# EAGLE design keyBoard (EAGLE 8.3.2)
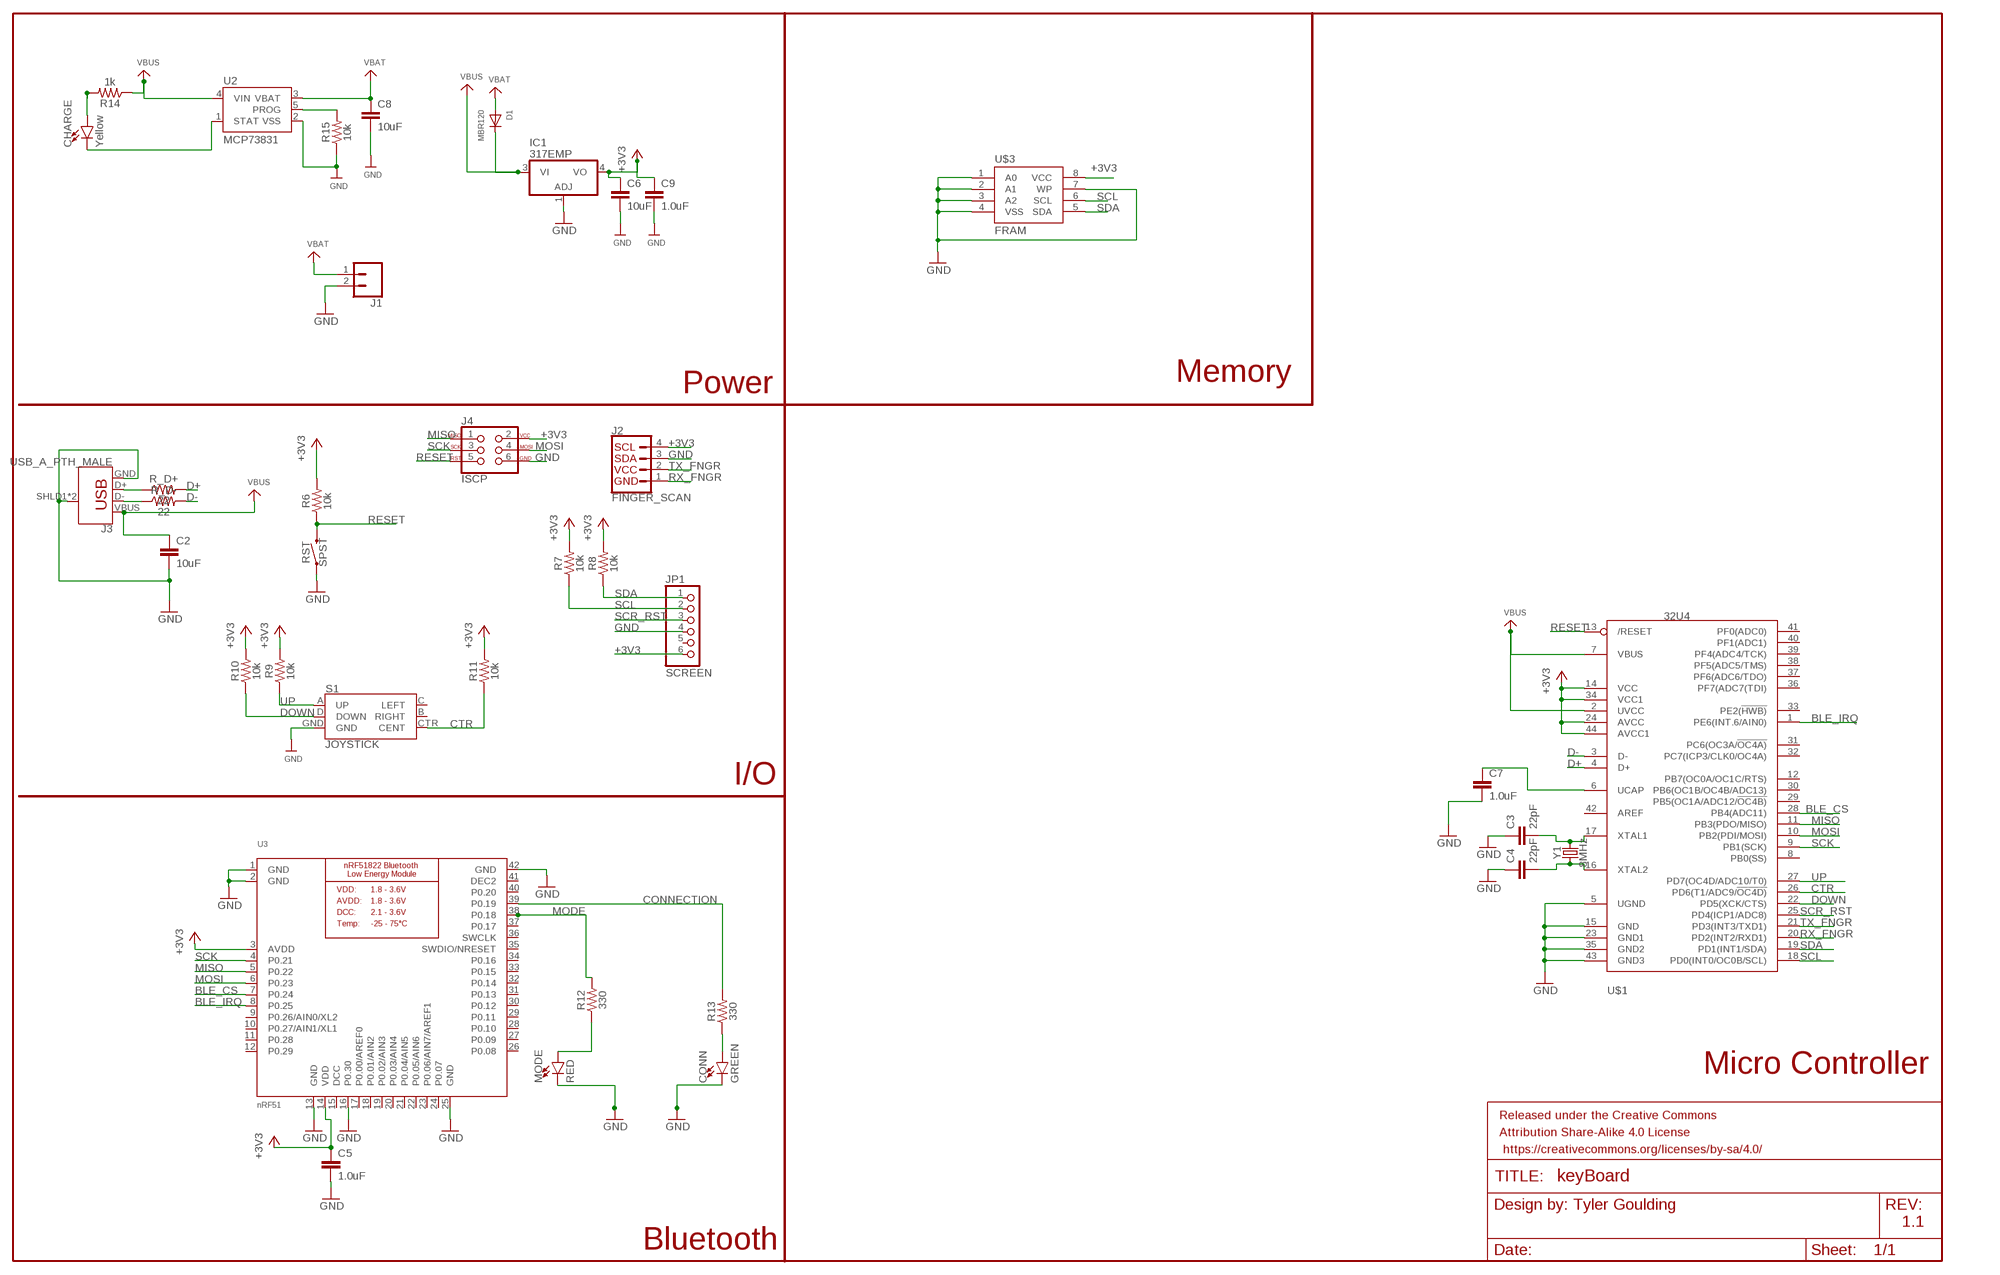
[diagram p0: schematic, sheet 1]

## Parts
C2  10uF  10UF-0603-6.3V-20%  [0603]
C3  22pF  22PF-0603-50V-5%  [0603]
C4  22pF  22PF-0603-50V-5%  [0603]
C5  1.0uF  1.0UF-0603-16V-10%  [0603]
C6  10uF  10UF-0603-6.3V-20%  [0603]
C7  1.0uF  1.0UF-0603-16V-10%  [0603]
C8  10uF  10UF-0603-6.3V-20%  [0603]
C9  1.0uF  1.0UF-0603-16V-10%  [0603]
CHARGE  Yellow  LED-YELLOW0603  [LED-0603]
CONN  GREEN  LED-GREEN0603  [LED-0603]
D1  MBR120  DIODE_SOD-123FL  [SOD-123FL]
FRAME1  FRAME-LEDGER  [CREATIVE_COMMONS]
IC1  317EMP  [SOT223]
J1  CONN_02JST-PTH-2  [JST-2-PTH]
J2  FINGER_SCAN  QWIIC_CONNECTORJS-1MM  [1X04_1MM_RA]
J3  USB_A_PTH_MALE  [USB-A-H]
J4  ISCP  AVR_SPI_PROG_3X2NS  [2X3-NS]
JP1  SCREEN  HEADER-1X6ROUND  [1X06_ROUND]
MODE  RED  LED-RED0603  [LED-0603]
R6  10k  10KOHM-0603-1/10W-1%  [0603]
R7  10k  10KOHM-0603-1/10W-1%  [0603]
R8  10k  10KOHM-0603-1/10W-1%  [0603]
R9  10k  10KOHM-0603-1/10W-1%  [0603]
R10  10k  10KOHM-0603-1/10W-1%  [0603]
R11  10k  10KOHM-0603-1/10W-1%  [0603]
R12  330  330OHM-0603-1/10W-1%  [0603]
R13  330  330OHM-0603-1/10W-1%  [0603]
R14  1k  1KOHM-0603-1/10W-1%  [0603]
R15  10k  10KOHM-0603-1/10W-1%  [0603]
R_D+  22  22OHM-0603-1/10W-1%  [0603]
R_D-  22  22OHM-0603-1/10W-1%  [0603]
RST  SPST  MOMENTARY-SWITCH-SPST-SMD-4.5MM  [TACTILE_SWITCH_SMD_4.5MM]
S1  JOYSTICK  JOYSTICK_MINI  [JOYSTICK_MINI]
U2  MCP73831  [SOT23-5]
U3  nRF51  NRF51822_MODULE_MDBT40  [BLE_MODULE_RAYTAC_MDBT40]
U$1  32U4  ATMEGA32U4-AU  [TQFP44]
U$3  FRAM  [SOIC8]
Y1  8MHz  CRYSTAL-8MHZSMD-5X3.2  [CRYSTAL-SMD-5X3.2-4PAD]

## Nets
+3V3: C5.1 C6.1 C9.1 IC1.4(VO) J2.4(SCL) J4.2 JP1.6 R6.2 R7.2 R8.2 R9.2 R10.2 R11.2 U3.3(AVDD) U3.14(VDD) U$1.14(VCC) U$1.24(AVCC) U$1.34(VCC1) U$1.44(AVCC1) U$3.8(VCC)
BLE_CS: U3.7(P0.24) U$1.28(PB4(ADC11))
BLE_IRQ: U3.8(P0.25) U$1.1(PE6(INT.6/AIN0))
CONNECTION: R13.2 U3.39(P0.19)
CTR: R11.1 S1.CTR(CENT) U$1.26(PD6(T1/ADC9/!OC4D))
D+: R_D+.2 U$1.4(D+)
D-: R_D-.2 U$1.3(D-)
DOWN: R10.1 S1.D(DOWN) U$1.22(PD5(XCK/CTS))
GND: C2.2 C3.1 C4.1 C5.2 C6.2 C7.2 C8.2 C9.2 CONN.C IC1.1(ADJ) J1.2 J2.3(SDA) J3.GND J3.SHLD1(SHIELD) J3.SHLD2(SHIELD) J4.6 JP1.4 MODE.C R15.1 RST.2 RST.3 S1.GND U2.2(VSS) U3.1(GND) U3.2(GND) U3.13(GND) U3.16(P0.30) U3.25(GND) U3.42(GND) U$1.5(UGND) U$1.15(GND) U$1.23(GND1) U$1.35(GND2) U$1.43(GND3) U$3.1(A0) U$3.2(A1) U$3.3(A2) U$3.4(VSS) U$3.7(WP)
MISO: J4.1 U3.5(P0.22) U$1.11(PB3(PDO/MISO))
MODE: R12.2 U3.38(P0.18)
MOSI: J4.4 U3.6(P0.23) U$1.10(PB2(PDI/MOSI))
N$1: CHARGE.A R14.2
N$2: J3.D+ R_D+.1
N$3: J3.D- R_D-.1
N$4: MODE.A R12.1
N$6: R15.2 U2.5(PROG)
N$7: CONN.A R13.1
RESET: J4.5 R6.1 RST.1 RST.4 U$1.13(/RESET)
RX_FNGR: J2.1(GND) U$1.20(PD2(INT2/RXD1))
SCK: J4.3 U3.4(P0.21) U$1.9(PB1(SCK))
SCL: JP1.2 R7.1 U$1.18(PD0(INT0/OC0B/SCL)) U$3.6(SCL)
SCR_RST: JP1.3 U$1.25(PD4(ICP1/ADC8))
SDA: JP1.1 R8.1 U$1.19(PD1(INT1/SDA)) U$3.5(SDA)
STAT: CHARGE.C U2.1(STAT)
TX_FNGR: J2.2(VCC) U$1.21(PD3(INT3/TXD1))
UCAP: C7.1 U$1.6(UCAP)
UP: R9.1 S1.A(UP) U$1.27(PD7(OC4D/ADC10/T0))
VBAT: C8.1 D1.A J1.1 U2.3(VBAT)
VBUS: C2.1 D1.C IC1.3(VI) J3.VBUS R14.1 U2.4(VIN) U$1.2(UVCC) U$1.7(VBUS)
XTAL1: C3.2 U$1.17(XTAL1) Y1.3
XTAL2: C4.2 U$1.16(XTAL2) Y1.1
Unconnected: JP1.5 S1.B(RIGHT) S1.C(LEFT) U3.9(P0.26/AIN0/XL2) U3.10(P0.27/AIN1/XL1) U3.11(P0.28) U3.12(P0.29) U3.17(P0.00/AREF0) U3.18(P0.01/AIN2) U3.19(P0.02/AIN3) U3.20(P0.03/AIN4) U3.21(P0.04/AIN5) U3.22(P0.05/AIN6) U3.23(P0.06/AIN7/AREF1) U3.24(P0.07) U3.26(P0.08) U3.27(P0.09) U3.28(P0.10) U3.29(P0.11) U3.30(P0.12) U3.31(P0.13) U3.32(P0.14) U3.33(P0.15) U3.34(P0.16) U3.35(SWDIO/NRESET) U3.36(SWCLK) U3.37(P0.17) U3.40(P0.20) U$1.8(PB0(SS)) U$1.12(PB7(OC0A/OC1C/RTS)) U$1.29(PB5(OC1A/ADC12/!OC4B)) U$1.30(PB6(OC1B/OC4B/ADC13)) U$1.31(PC6(OC3A/!OC4A)) U$1.32(PC7(ICP3/CLK0/OC4A)) U$1.33(PE2(!HWB)) U$1.36(PF7(ADC7(TDI)) U$1.37(PF6(ADC6/TDO)) U$1.38(PF5(ADC5/TMS)) U$1.39(PF4(ADC4/TCK)) U$1.40(PF1(ADC1)) U$1.41(PF0(ADC0)) U$1.42(AREF)

## Notes on the sheet
- Memory
- Power
- I/O
- Micro Controller
- Tyler Goulding
- 1.1
- Bluetooth

## Power pins joined to a net without a drawn wire
DCC: U3.15(DCC)
DEC2: U3.41(DEC2)

## Library data of the parts
C2 C6 C8 = SparkFun-Capacitors:10UF: 10.0µF ceramic capacitors A capacitor is a passive two-terminal electrical component used to store electrical energy temporarily in an electric field.; PROD_ID: CAP-11015
C3 C4 = SparkFun-Capacitors:22PF: 22pF ceramic capacitors A capacitor is a passive two-terminal electrical component used to store electrical energy temporarily in an electric field.; PROD_ID: CAP-07876
C5 C7 C9 = SparkFun-Capacitors:1.0UF: 1µF ceramic capacitors A capacitor is a passive two-terminal electrical component used to store electrical energy temporarily in an electric field.; PROD_ID: CAP-00868
CHARGE = SparkFun-LED:LED-YELLOW: Yellow SMD LED Used in manufacturing several products at SparkFun. Packages: 0603 - SMD 0603 package[Product Link] <http://www.kingbrightusa.com/product.asp?catalog_name=LED&product_id=APT1608SYCK> 0603 -SMART - SMART SMD 0603 package (more efficient/more expensive) [Product Link] <http://www.osram-os.com/osram_os/en/products/product-catalog/led-light-emitting-diodes/smartled-0603/ly-l29k/index.jsp> LilyPad - SMD1206 package[Product Datasheet] <https://www.sparkfun.com/datasheets/DevTools/LilyPad/Q150YUS4.pdf> SparkFun Products: Blynk Board <https://www.sparkfun.com/products/13794> IOIO-OTG <https://www.sparkfun.com/products/13613> XBee Explorer Serial <https://www.sparkfun.com/products/13225>; PROD_ID: DIO-09003
CONN = SparkFun-LED:LED-GREEN: Green SMD LED Used in manufacturing of various products at SparkFun Packages: 0603 - SMD 0603 package [Product Link] <http://www.futureelectronics.com/en/technologies/semiconductors/optoelectronics/leds/Pages/9894312-LTST-C190GKT.aspx?CrossPart=HSMG-C190&IM=0> LilyPad 1206 - SMD1206 LilyPad package [Product Link] <http://www.futureelectronics.com/en/Technologies/Product.aspx?ProductID=IN150NGHARVATEKCORPORATION2049943&IM=0> 1206 - SMD1206 package [Product Link] <http://www.futureelectronics.com/en/technologies/semiconductors/optoelectronics/leds/Pages/8315665-LTST-C150KGKT.aspx?IM=0> 1206 Bottom Mount -SMD 1206 Bottom Mount [Product Link] <http://www.digikey.com/product-detail/en/lite-on-inc/LTST-C230KGKT/160-1456-1-ND/386854> SparkFun Products: Pro Mini 328 -5V <https://www.sparkfun.com/products/821> RedBoard <https://www.sparkfun.com/products/12757> MP3 Trigger <https://www.sparkfun.com/products/13720> Makey Makey <https://www.sparkfun.com/products/11076>; PROD_ID: DIO-00821
D1 = adafruit:DIODE: Diode SMADIODE - SMA Surface Mount Package 20V 1A Schottky Diode Digikey: 641-1014-6-ND DO-1N4148 - Through Hole Small Current Diode SOD-123 20V 1 A (.5mV Vf) Schottky Diode - Digikey: MBRX120TPMSCT-ND SOD-323 10V 570mA (.38mV Vf, 3ns) Schottky Diode - Digikey: ZLLS410CT-ND SOD-523 30V 30mA Schottky Diode (RB751S-40TE61) - Digikey: RB751S-40TE61CT-ND SOT23-R/W - SOT23 Package (R = Solder Paste/Reflow Ovens, W = Hand-Soldering) BAT54Film 40V 300mA - Digikey: 497-7162-1-ND
FRAME1 = SparkFun-Aesthetics:FRAME-LEDGER: Schematic Frame - Ledger Standard 11x14 US Ledger frame
IC1 = linear:*317: Positive VOLTAGE REGULATOR
J1 = SparkFun-Connectors:CONN_02: Multi connection point. Often used as Generic Header-pin footprint for 0.1 inch spaced/style header connections On any of the 0.1 inch spaced packages, you can populate with these: Break Away Headers - Straight <https://www.sparkfun.com/products/116> (PRT-00116) Break Away Male Headers - Right Angle <https://www.sparkfun.com/products/553> (PRT-00553) Female Headers <https://www.sparkfun.com/products/115> (PRT-00115) Break Away Headers - Machine Pin <https://www.sparkfun.com/products/117> (PRT-00117) Break Away Female Headers - Swiss Machine Pin <https://www.sparkfun.com/products/743> (PRT-00743) For SCREWTERMINALS and SPRING TERMINALS visit here: Screw Terimnals on SparkFun.com <https://www.sparkfun.com/search/results?term=Screw+Terminals> (5mm/3.5mm/2.54mm spacing) This device is also useful as a general connection point to wire up your design to another part of your project. Our various solder wires solder well into these plated through hole pads. Hook-Up Wire - Assortment (Stranded, 22 AWG) <https://www.sparkfun.com/products/11375> (PRT-11375) Hook-Up Wire - Assortment (Solid Core, 22 AWG) <https://www.sparkfun.com/products/11367> (PRT-11367) View the entire wire category on our website here <https://www.sparkfun.com/categories/141> Special notes: Molex polarized connector foot print use with: PRT-08233 with associated crimp pins and housings. 2.54_SCREWTERM for use with PRT-10571. 3.5mm Screw Terminal footprints for PRT-08084 5mm Screw Terminal footprints for use with PRT-08432; PROD_ID: CONN-09863; SKU: PRT-09914
J2 = SparkFun-Connectors:QWIIC_CONNECTOR: SparkFun I2C Standard Qwiic Connector An SMD 1mm pitch JST connector makes it easy and quick (get it? Qwiic?) to connect I2C devices to each other. The Qwiic system <http://www.sparkfun.com/qwiic> enables fast and solderless connection between popular platforms and various sensors and actuators. We carry 200mm <https://www.sparkfun.com/products/14204>, 100mm <https://www.sparkfun.com/products/14205>, 50mm <https://www.sparkfun.com/products/14206>, and breadboard friendly <https://www.sparkfun.com/products/14207> Qwiic cables. We also offer 10 pcs strips <https://www.sparkfun.com/products/14323> the SMD connectors.
J3 = SparkFun-Connectors:USB_A: USB-A Connector Male and female variants, as well as PTH and SMT variants SparkFun Products: SparkFun XBee Explorer Dongle <https://www.sparkfun.com/products/11697> PTH Male SparkFun MicroView-USB Programmer <https://www.sparkfun.com/products/12924> SMT Male SparkFun USB Type A Female Breakout <https://www.sparkfun.com/products/12700> SMT Female; PROD_ID: CONN-08367; SF_ID: PRT-00437
J4 = SparkFun-Connectors:AVR_SPI_PROG_3X2: AVR ISP 6 Pin This is the reduced ISP connector for AVR programming. Common on Arduino. This footprint will take up less PCB space and can be used with a 10-pin to 6-pin adapter such as SKU: BOB-08508 **Special note about "TEST_POINT" package. The stop mask is on the top side, so if you want your programming test points to be on the bottom of your board, make sure to place this package on the bottom side of the board. This also ensure that the orientation to program from the bottom side will be correct. SparkFun Products: SparkFun ISP Pogo Adapter <https://www.sparkfun.com/products/11591> - NS Tiny AVR Programmer <https://www.sparkfun.com/products/11801> -PTH
JP1 = display:HEADER-1X6: PIN HEADER
MODE = SparkFun-LED:LED-RED: Red SMD LED Used in manufacturing of most products at SparkFun Packages: 0603 - SMD 0603 package [Product Link] <http://docs.avagotech.com/docs/AV02-0551EN> 0603 SMART - SMD 0603 SMART package ( more efficient and expensive)[Product Link] <http://www.osram-os.com/Graphics/XPic2/00077099_0.pdf> 1206 - SMD1206 package [Product Link] <https://www.sparkfun.com/datasheets/DevTools/LilyPad/Q150OVS4.pdff> SparkFun Products: Pro Mini 328 -5V <https://www.sparkfun.com/products/821> RedBoard <https://www.sparkfun.com/products/12757> IOIO-OTG <https://www.sparkfun.com/products/13613>; PROD_ID: DIO-00819
R6-R11 R15 = SparkFun-Resistors:10KOHM: 10kΩ resistor A resistor is a passive two-terminal electrical component that implements electrical resistance as a circuit element. Resistors act to reduce current flow, and, at the same time, act to lower voltage levels within circuits. - Wikipedia; PROD_ID: RES-00824
R12 R13 = SparkFun-Resistors:330OHM: 330Ω resistor A resistor is a passive two-terminal electrical component that implements electrical resistance as a circuit element. Resistors act to reduce current flow, and, at the same time, act to lower voltage levels within circuits. - Wikipedia; PROD_ID: RES-00818
R14 = SparkFun-Resistors:1KOHM: 1kΩ resistor A resistor is a passive two-terminal electrical component that implements electrical resistance as a circuit element. Resistors act to reduce current flow, and, at the same time, act to lower voltage levels within circuits. - Wikipedia; PROD_ID: RES-07856
R_D+ R_D- = SparkFun-Resistors:22OHM: 22Ω resistor A resistor is a passive two-terminal electrical component that implements electrical resistance as a circuit element. Resistors act to reduce current flow, and, at the same time, act to lower voltage levels within circuits. - Wikipedia; PROD_ID: RES-08698
RST = SparkFun-Switches:MOMENTARY-SWITCH-SPST: Momentary Switch (Pushbutton) - SPST Normally-open (NO) SPST momentary switches (buttons, pushbuttons). Variants PTH-12MM - 12mm square, through-hole Momentary Pushbutton Switch - 12mm Square <https://www.sparkfun.com/products/9190> (COM-09190) PTH-6.0MM, PTH-6.0MM-KIT - 6.0mm square, through-hole Mini Pushbutton Switch <https://www.sparkfun.com/products/97> (COM-00097) KIT package intended for soldering kit's - only one side of pads' copper is exposed. PTH-RIGHT-ANGLE-KIT - Right-angle, through-hole Right Angle Tactile Button <https://www.sparkfun.com/products/10791> - Used on SparkFun BigTime Watch Kit <https://www.sparkfun.com/products/11734> SMD-12MM - 12mm square, surface-mount Tactile Button - SMD (12mm) <https://www.sparkfun.com/products/12993> (COM-12993) Used on SparkFun PicoBoard <https://www.sparkfun.com/products/11888> SMD-4.5MM - 4.5mm Square Trackball Switch Used on SparkFun Blackberry Trackballer Breakout <https://www.sparkfun.com/products/13169> SMD-4.6MMX2.8MM - 4.60mm x 2.80mm, surface mount Used on SparkFun SAMD21 Mini Breakout <https://www.sparkfun.com/products/13664> SMD-5.2MM, SMD-5.2-REDUNDANT - 5.2mm square, surface-mount Mini Pushbutton Switch - SMD <https://www.sparkfun.com/products/8720> (COM-08720) Used on Arduino Pro Mini <https://www.sparkfun.com/products/11114> REDUNDANT package connects both switch circuits together SMD-6.0X3.5MM - 6.0 x 3.5mm, surface mount Momentary Reset Switch SMD <https://www.sparkfun.com/products/8229> (COM-08229) SMD-6.2MM-TALL - 6.2mm square, surface mount Tactile Button - SMD (6mm) <https://www.sparkfun.com/products/12992> Used on SparkFun Digital Sandbox <https://www.sparkfun.com/products/12651> SMD-RIGHT-ANGLE - Right-angle, surface mount Used on SparkFun Block for Intel® Edison - Arduino <https://www.sparkfun.com/products/13036>; PROD_ID: SWCH-09213
S1 = SparkFun-Switches:JOYSTICK_MINI: Small Tactile Joystick w/ Select Switch A 5-way tactile switch allows for a joystick-like interface in a very small package. Part #: 4UCON SF303GJ26 SparkFun Products 5-way Tactile Switch <https://www.sparkfun.com/products/10063> (COM-10063) Used on SparkFun Block for Intel® Edison - OLED <https://www.sparkfun.com/products/13035> (DEV-13035) Used on CAN-BUS Shield <https://www.sparkfun.com/products/13262> (DEV-13262); PROD_ID: SWCH-09905; SF_SKU: COM-10063
U2 = SparkFun-IC-Power:MCP73831: MCP73831T Li-Ion, Li-Pol Controller Miniature single cell, fully integrated Li-Ion, Li-polymer charge management controller Datasheet <http://ww1.microchip.com/downloads/en/DeviceDoc/20001984g.pdf> SparkFun Products: SparkFun ESP32 Thing <https://www.sparkfun.com/products/13907> SparkFun 9DoF Razor IMU M0 <https://www.sparkfun.com/products/14001>; PROD_ID: IC-09995
U3 = microbuilder:NRF51822_MODULE_MDBT40: nRF51822 Bluetooth Low Energy Module
U$1 = adafruit:ATMEGA32U4: http://www.ladyada.net/library/eagle
U$3 = fram:FRAM
Y1 = SparkFun-Clocks:CRYSTAL-8MHZ: 8MHz Crystal Datasheet Example <http://www.futureelectronics.com/en/technologies/electromechanical/timing-devices/crystals/Pages/6008189-ABM3B-8.000MHZ-B2-T.aspx?IM=0> Frequency: 8MHz Frequency Tolerance: ±20ppm Load Capacitance: 18pF SparkFun Products: Pro Micro -3.3V/8MHz <https://www.sparkfun.com/products/12587> WAV Trigger <https://www.sparkfun.com/products/13660>; PROD_ID: XTAL-09431

## Board
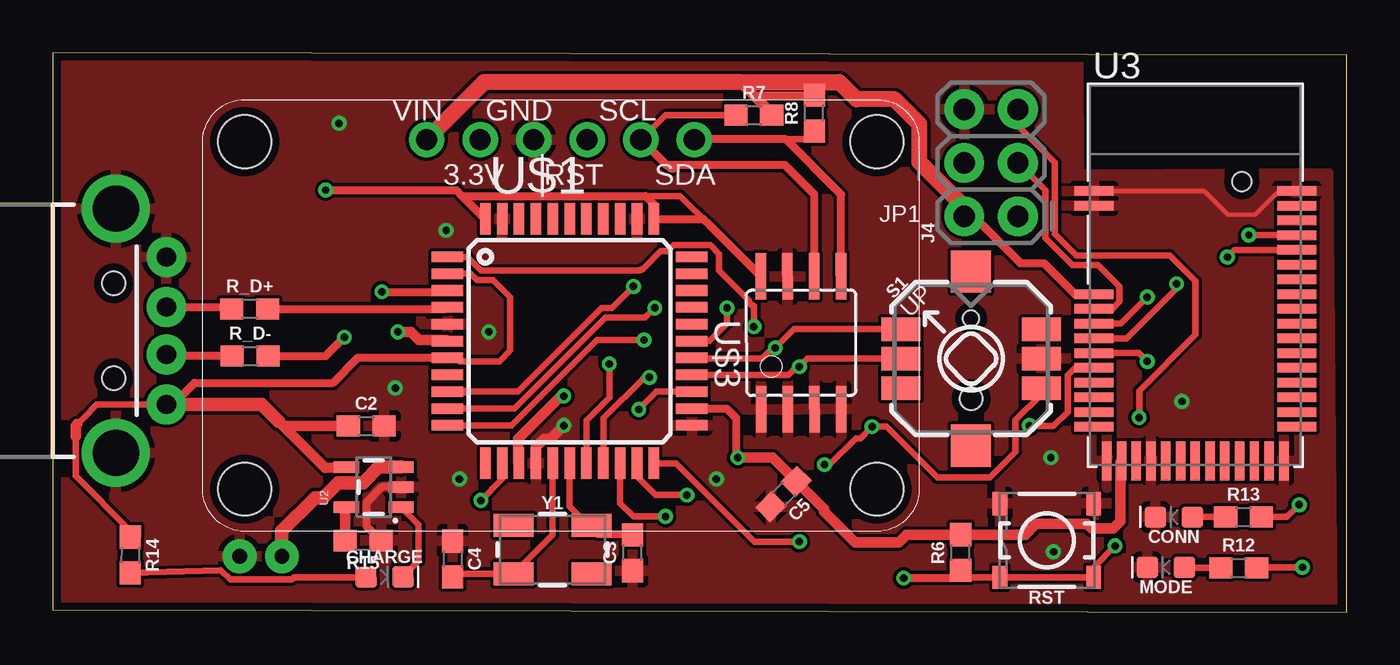
[diagram p1: board, top side]
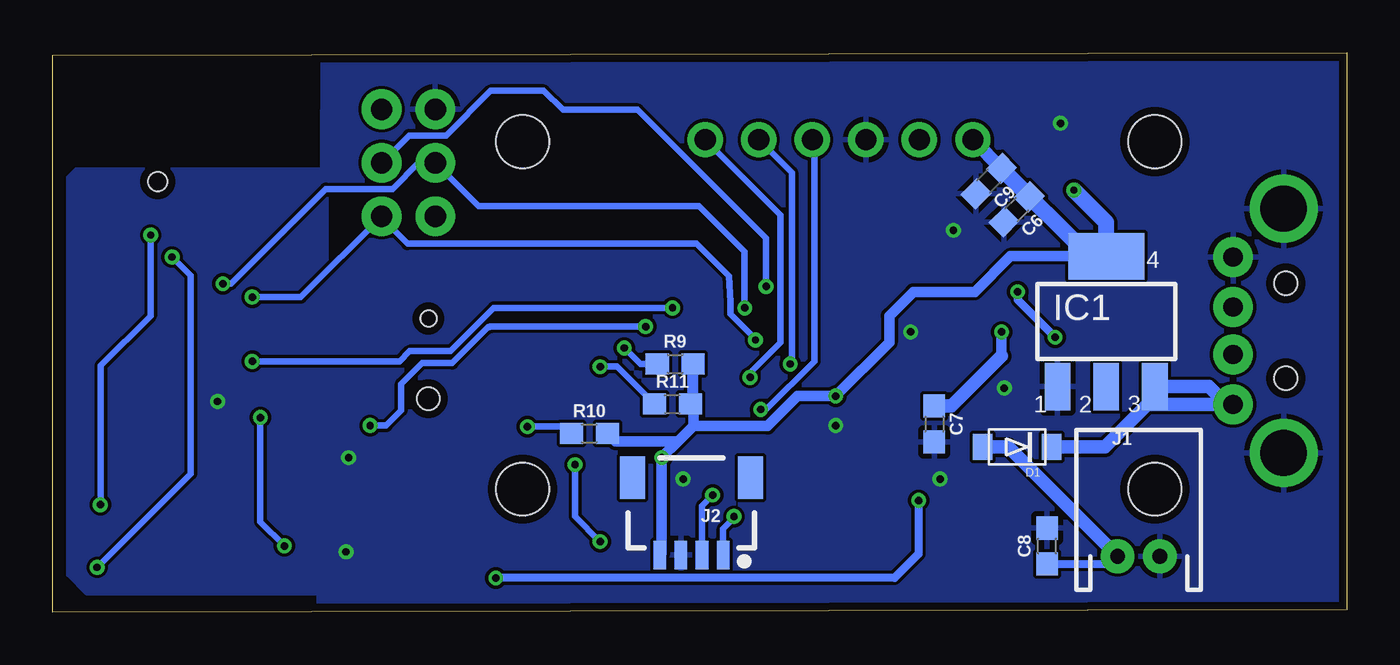
[diagram p2: board, bottom side, seen from below]

Size 61.42 x 26.57 mm. Coordinates in mm from the lower left corner, seen from the top.
Outline: 0,0.13 61.42,0 61.42,26.44 0,26.57 0,0.13
Copper layers (1*16): Top 0.0356mm / dielectric 1.5011mm / Bottom 0.0356mm
Design rules "LaenPCBOrder": minimum track width 6mil, minimum drill 13mil, track to track 6mil, track to pad 6mil, pad to pad 6mil, via to via 6mil, smd to smd 6mil, copper to edge 15mil, drill to drill 6mil, minimum pad ring 7mil, minimum via ring 7mil, stop-mask expansion 3mil, vias tented up to drill 0mil, thermal gap 10mil

### Footprints (pad centres in the part's own frame; a part is rotated, then mirrored left to right if it is on the bottom)
0603 = smd 1.1 x 1: 1 -0.85,0; 2 0.85,0
LED-0603 = smd 1 x 1: A -0.877,0; C 0.877,0
SOD-123FL = smd 0.91 x 1.22: A 1.637,0; C -1.637,0
SOT223 = smd 1.219 x 2.235: 1 -2.311,-3.099; 2 0,-3.099; 3 2.311,-3.099 | smd 3.6 x 2.2: 4 0,3.099
JST-2-PTH = drill 0.7 pad 1.6: 1 -1,0; 2 1,0
1X04_1MM_RA = smd 0.6 x 1.35: 1 -1.5,0; 2 -0.5,0; 3 0.5,0; 4 1.5,0 | smd 1.2 x 2: NC1 2.8,-3.675; NC2 -2.8,-3.675
USB-A-H = drill 0.914 pad 1.88: D+ 2.4,1.127; D- 2.4,-1.127; GND 2.4,3.5; VBUS 2.4,-3.5 | drill 2.2: SHLD1 0,-5.8; SHLD2 0,5.8 | hole 1.1: -0.1,2.25; -0.1,-2.25
2X3-NS = drill 1.016 pad 1.88: 1 -2.54,-1.27; 2 -2.54,1.27; 3 0,-1.27; 4 0,1.27; 5 2.54,-1.27; 6 2.54,1.27
1X06_ROUND = drill 1 pad 1.676: 1 10.668,1.905; 2 13.208,1.905; 3 15.748,1.905; 4 18.288,1.905; 5 20.828,1.905; 6 23.368,1.905 | hole 2.5: 2,2; 2,18.5; 32,18.5; 32,2
TACTILE_SWITCH_SMD_4.5MM = smd 0.7 x 1.1: 1 2.225,1.75; 2 2.225,-1.75; 3 -2.225,-1.75; 4 -2.225,1.75
JOYSTICK_MINI = smd 1.85 x 1.1: A -3.325,1.4; B 3.325,1.4; C -3.325,-1.4; CTR -3.325,0; D 3.325,-1.4; GND 3.325,0 | smd 1.9 x 2: NC 0,4.13; NC@0 0,-4.13 | hole 0.75: 0,1.9 | hole 1.05: 0,-1.9
SOT23-5 = smd 0.55 x 1.2: 1 -0.95,-1.3; 2 0,-1.3; 3 0.95,-1.3; 4 0.95,1.3; 5 -0.95,1.3
BLE_MODULE_RAYTAC_MDBT40 = smd 1.85 x 0.45: 1 -4.825,4; 2 -4.825,3.3; 3 -4.825,-0.9; 4 -4.825,-1.6; 5 -4.825,-2.3; 6 -4.825,-3; 7 -4.825,-3.7; 8 -4.825,-4.4; 9 -4.825,-5.1; 10 -4.825,-5.8; 11 -4.825,-6.5; 12 -4.825,-7.2; 26 4.825,-7.2; 27 4.825,-6.5; 28 4.825,-5.8; 29 4.825,-5.1; 30 4.825,-4.4; 31 4.825,-3.7; 32 4.825,-3; 33 4.825,-2.3; 34 4.825,-1.6; 35 4.825,-0.9; 36 4.825,-0.2; 37 4.825,0.5; 38 4.825,1.2; 39 4.825,1.9; 40 4.825,2.6; 41 4.825,3.3; 42 4.825,4 | smd 0.45 x 1.85: 13 -4.2,-8.825; 14 -3.5,-8.825; 15 -2.8,-8.825; 16 -2.1,-8.825; 17 -1.4,-8.825; 18 -0.7,-8.825; 19 0,-8.825; 20 0.7,-8.825; 21 1.4,-8.825; 22 2.1,-8.825; 23 2.8,-8.825; 24 3.5,-8.825; 25 4.2,-8.825 | hole 0.9: 2.2,4.45
TQFP44 = smd 1.5 x 0.5: 1 -5.8,4; 2 -5.8,3.2; 3 -5.8,2.4; 4 -5.8,1.6; 5 -5.8,0.8; 6 -5.8,0; 7 -5.8,-0.8; 8 -5.8,-1.6; 9 -5.8,-2.4; 10 -5.8,-3.2; 11 -5.8,-4; 23 5.8,-4; 24 5.8,-3.2; 25 5.8,-2.4; 26 5.8,-1.6; 27 5.8,-0.8; 28 5.8,0; 29 5.8,0.8; 30 5.8,1.6; 31 5.8,2.4; 32 5.8,3.2; 33 5.8,4 | smd 0.5 x 1.5: 12 -4,-5.8; 13 -3.2,-5.8; 14 -2.4,-5.8; 15 -1.6,-5.8; 16 -0.8,-5.8; 17 0,-5.8; 18 0.8,-5.8; 19 1.6,-5.8; 20 2.4,-5.8; 21 3.2,-5.8; 22 4,-5.8; 34 4,5.8; 35 3.2,5.8; 36 2.4,5.8; 37 1.6,5.8; 38 0.8,5.8; 39 0,5.8; 40 -0.8,5.8; 41 -1.6,5.8; 42 -2.4,5.8; 43 -3.2,5.8; 44 -4,5.8
SOIC8 = smd 0.5 x 2.2: 1 -1.905,-3.154; 2 -0.645,-3.154; 3 0.625,-3.154; 4 1.895,-3.154; 5 1.905,3.154; 6 0.635,3.154; 7 -0.635,3.154; 8 -1.905,3.154
CRYSTAL-SMD-5X3.2-4PAD = smd 1.9 x 1.1: 1 -1.85,-1.15; 2 1.85,-1.15; 3 1.85,1.15; 4 -1.85,1.15

### Placement (x,y rotation side)
C2  14.88,8.84 0 top
C3  27.52,2.83 90 top
C4  18.98,2.53 270 top
C5  34.69,5.62 225 top
C6  15.67,19.13 225 bottom
C7  19.58,8.94 270 bottom
C8  14.22,3.15 90 bottom
C9  16.99,20.47 225 bottom
CHARGE  15.75,1.68 0.4 top
CONN  53.21,4.52 180 top
D1  15.65,7.85 180 bottom
FRAME1  9.35,-20.95 0 top  (outside the outline)
IC1  11.42,13.81 0 bottom
J1  9.88,2.66 0 bottom
J2  31.1,2.72 180 bottom
J3  3,13.37 0 top
J4  44.54,21.34 90 top
JP1  41.12,24.35 180 top
MODE  52.83,2.14 180 top
R6  43.09,2.84 90 top
R7  33.27,23.6 0 top
R8  36.14,23.7 90 top
R9  31.88,11.79 0 bottom
R10  35.94,8.49 0 bottom
R11  32,9.88 0 bottom
R12  56.29,2.11 0 top
R13  56.52,4.52 0 top
R14  3.68,2.72 269.7 top
R15  14.73,3.41 180 top
R_D+  9.35,14.41 0 top
R_D-  9.37,12.17 0 top
RST  47.18,3.41 180 top
S1  43.59,12.04 0 top
U2  15.24,5.95 90 top
U3  54.23,16.01 0 top
U$1  24.53,12.88 0 top
U$3  35.52,12.8 0.2 top
Y1  23.72,2.97 0 top

### Tracks (layer width: path | path; a pad name or v marks a point on that pad's centre or on a via)
+3V3  (via drill 0.35)
  Top 0.305: 28.12,19.77 29.78,19.77 31.2,18.35
  Top 0.381: v12.95,20.04 19.17,20.04 19.44,19.77 | 19.44,19.77 U$1.44 | U3.3 48.5,15.11 47.03,16.57 45.92,16.57 43.69,18.8 J4.2 | 19.44,19.77 28.12,19.77 28.53,19.36 U$1.34 30.87,18.68 31.2,18.35 U$3.8 | U$1.24 31.98,9.68 32.44,9.22 32.44,7.42 v32.51,7.34 | 33.26,24.55 R8.2 | 33.26,24.55 32.97,24.84 32.82,25 32.64,25.17 | 34.12,23.69 33.26,24.55
  Top 0.508: v24.26,10.26 24.13,10.26 22.1,8.23 22.1,7.11 U$1.14 | v32.51,7.34 34.16,7.34 C5.1 36.6,4.91 36.6,4.8 38.07,3.33 40.16,3.33 40.52,3.69 R6.2 46.16,3.69 46.67,4.19 49.08,4.19 49.29,3.98 50.33,3.98 50.66,4.31 50.66,7.11 U3.14 | 32.82,25 33.26,24.55 34.12,23.69 R7.2
  Top 0.762: J4.2 43.27,19.25 41.13,21.38 41.13,23.18 39.95,24.36 38.15,24.36 37.34,25.17 32.64,25.17 20.48,25.17 JP1.6
  Bottom 0.305: R11.2 31.15,11.66 R9.2
  Bottom 0.381: 16.31,21 14.77,19.46 C6.1 14.68,19.37 12.31,17
  Bottom 0.508: IC1.4 15.96,16.91 17.65,15.22 20.57,15.22 21.72,14.07 21.72,12.8 v24.26,10.26 26.07,10.26 27.49,8.84 31.01,8.84 | 31.75,8.1 v32.51,7.34 32.51,2.81 J2.4 | 31.75,8.1 31.01,8.84 | 31.01,8.84 31.01,9.74 31.03,9.75 | 31.03,9.75 R11.2 | R9.2 31.03,9.75 | 31.75,8.1 34.71,8.1 R10.2
  Bottom 0.635: JP1.6 16.31,21 | C9.1 16.16,20.77 C6.1
  Bottom 0.762: 16.31,21 12.31,17 12.22,16.91 IC1.4 11.42,18.51 v12.95,20.04
BLE_CS  (via drill 0.35)
  Top 0.305: U3.7 51.55,12.31 v51.94,11.91 | U$1.28 31.17,12.88 32,13.71 v32,14.45
  Bottom 0.305: v51.94,11.91 44.96,11.91 44.47,12.4 42.54,12.4 40.48,14.45 v32,14.45
BLE_IRQ  (via drill 0.35)
  Top 0.305: U$1.1 19.68,16.88 20.32,16.24 27.82,16.24 arc45 28.03,16.33 28.85,17.15 29.17,17.15 29.46,17.43 31.21,17.43 31.62,17.02 31.62,16.23 33.05,14.8 33.05,14.72 33.23,14.54 33.27,14.54 v33.27,13.57 | v46.36,8.87 46.38,8.84 47.5,8.84 48.17,9.51 48.17,11.26 48.52,11.61 U3.8
  Bottom 0.305: v33.27,13.57 40.6,13.57 arc-45 40.82,13.48 42.46,11.83 43.88,11.83 44.87,10.84 44.87,9.59 45.59,8.87 v46.36,8.87
CONNECTION  (via drill 0.35)
  Top 0.305: v56.77,17.91 U3.39 | R13.2 58.57,4.52 v59.16,5.11
  Bottom 0.305: v56.77,17.91 56.77,14.07 59.13,11.71 59.13,5.13 v59.16,5.11
CTR  (via drill 0.35)
  Top 0.305: U$1.26 34.92,11.28 35.31,11.66 v35.43,11.66 35.81,12.04 S1.CTR
  Bottom 0.305: v35.43,11.66 34.63,11.66 R11.1
D+
  Top 0.381: R_D+.2 18.66,14.41 U$1.4
D-  (via drill 0.35)
  Top 0.381: U$1.3 18.67,15.22 v15.62,15.22 | R_D-.2 12.95,12.17 v13.84,13.06
  Bottom 0.381: v15.62,15.22 15.62,14.83 v13.84,13.06
DOWN  (via drill 0.35)
  Top 0.305: v36.63,7.01 36.86,7.01 38.11,8.26 38.34,8.26 v38.89,8.82 39.57,8.82 41.98,6.4 44.47,6.4 45.7,7.62 45.7,9.14 46.91,10.35 S1.D | U$1.22 29.58,7.08 33.3,3.35 v35.43,3.35
  Bottom 0.305: v38.89,8.82 37.12,8.82 R10.1 | v36.63,7.01 36.63,4.55 v35.43,3.35
GND  (via drill 0.35)
  Top 0.203: U3.42 58.42,20.01 58.32,19.91 58.1,19.91 57.08,18.89 55.78,18.89 54.66,20.01 U3.1
  Top 0.381: U2.2 15.62,5.95 14.88,5.21 14.88,4.1 R15.1
  Top 0.508: v24.26,8.87 23.62,8.23 23.31,8.23 22.93,7.85 U$1.15 | 18.77,3.59 C4.1
  other vias: 47.5,2.87 20.7,13.31 19.3,6.33 13.59,23.22 16.26,10.64 31.5,6.33 53.59,10.01 47.37,7.34 18.67,18.14
  pour Top: 0.38,26.9 48.67,26.39 48.69,20.78 60.53,20.85 60.73,0.27 0.13,0.37
  pour Bottom: 0.08,26.57 0.08,1.8 0.03,0.37 48.77,0.45 48.62,21.29 48.59,26.47 0.25,26.39
  pour Bottom: 46.48,0.86 59.82,0.86 60.71,1.75 60.71,20.68 60.33,21.06 48.39,21.06 48.39,2.77
MISO  (via drill 0.35)
  Top 0.305: U3.5 50.69,13.71 v51.94,14.96 | U$1.11 21.78,8.88 25.83,12.93 v28.07,12.93
  Bottom 0.305: v51.94,14.96 49.65,14.96 45.84,18.77 | 45.84,18.77 J4.1 | 45.84,18.77 44.58,17.5 30.86,17.5 29.31,15.95 29.26,14.74 29.26,14.17 28.1,13.02 arc45 v28.07,12.93
MODE  (via drill 0.35)
  Top 0.305: U3.38 57.06,17.21 57.05,17.2 56.09,17.2 v55.75,16.87 | v59.31,2.14 57.16,2.14 R12.2
  Bottom 0.305: v55.75,16.87 54.86,15.98 54.86,6.58 v59.31,2.14
MOSI  (via drill 0.35)
  Top 0.305: U3.6 50.95,13.01 53.34,15.39 v53.34,15.6 | v28.57,14.45 28.11,13.99 26.25,13.99 21.93,9.68 U$1.10
  Bottom 0.305: v28.57,14.45 28.57,17.12 30.73,19.28 41.2,19.28 J4.4 44.05,21.34 45.29,20.1 48.46,20.1 52.96,15.6 v53.34,15.6
N$1
  Top 0.305: R14.2 7.98,2 8.42,1.55 11.33,1.55 | 11.33,1.55 11.45,1.67 | CHARGE.A 11.45,1.67 | 11.45,1.67 11.33,1.55
N$2
  Top 0.381: J3.D+ 8.41,14.49 R_D+.1
N$3
  Top 0.381: R_D-.1 5.47,12.17
  Top 0.508: 5.47,12.17 J3.D-
N$4
  Top 0.305: R12.1 53.73,2.11 MODE.A
N$6
  Top 0.508: R15.2 13.88,4.94 U2.5
N$7
  Top 0.305: CONN.A R13.1
RESET  (via drill 0.35)
  Top 0.305: J4.5 45.81,23.11 47.57,21.34 47.57,17.95 48.58,16.94 53.01,16.94 54.23,15.72 54.23,13.18 51.56,10.52 v51.56,9.25 | U$1.13 21.33,6.32 v20.32,5.31 | v50.42,3.15 49.4,2.13 RST.4 RST.1 43.42,1.66 R6.1
  Top 0.381: v40.39,1.63 42.73,1.63 R6.1
  Bottom 0.305: v51.56,9.25 51.56,4.29 v50.42,3.15
  Bottom 0.381: v40.39,1.63 21.46,1.63 20.32,2.77 v20.32,5.31
RX_FNGR  (via drill 0.35)
  Top 0.305: v29.08,4.55 27.56,4.55 26.93,5.18 U$1.20
  Bottom 0.305: v29.08,4.55 29.17,4.4 29.6,3.97 J2.1
SCK  (via drill 0.35)
  Top 0.305: J4.3 47.11,20.04 47.11,17.76 48.39,16.49 49.6,16.49 50.63,15.46 50.63,14.75 50.28,14.41 U3.4 | 19.68,10.48 22.08,10.48 26.06,14.45 26.54,14.45 v27.56,15.47
  Top 0.381: U$1.9 19.68,10.48
  Bottom 0.305: J4.3 44.51,22.64 42.75,22.64 40.62,24.76 38.11,24.76 37.2,23.85 33.66,23.85 27.56,17.76 v27.56,15.47
SCL  (via drill 0.35)
  Top 0.305: 29.46,21.02 arc-45 29.24,21.11 29.12,21.23 | v26.42,11.79 26.42,10.2 25.33,9.12 U$1.18 | R7.1 29.08,23.6 JP1.2
  Top 0.381: JP1.2 29.12,21.23 34.76,21.23 36.14,19.84 U$3.6
  Bottom 0.305: JP1.2 26.34,20.88 26.34,11.86 v26.42,11.79
SCR_RST  (via drill 0.35)
  Top 0.305: U$1.25 28.66,10.48 v27.81,9.63
  Bottom 0.305: JP1.3 25.27,22.35 25.27,11.91 27.56,9.63 v27.81,9.63
SDA  (via drill 0.35)
  Top 0.305: U$1.19 26.13,9.22 26.22,9.29 27.99,11.06 arc-45 28.2,11.15 v28.32,11.15 | 34.8,22.46 35.75,22.46 R8.1
  Top 0.381: U$3.5 37.41,19.84 34.8,22.46 30.46,22.46 JP1.1
  Bottom 0.305: JP1.1 26.88,18.87 26.88,12.8 28.23,11.45 arc-45 28.32,11.23 v28.32,11.15
STAT
  Top 0.305: U2.1 16.54,4.98 17.37,4.14 17.37,2.43 CHARGE.C
TX_FNGR  (via drill 0.35)
  Top 0.305: U$1.21 27.73,6.45 28.61,5.56 v30.1,5.56
  Bottom 0.305: J2.2 30.6,5.06 v30.1,5.56
UCAP  (via drill 0.35)
  Top 0.508: v16.38,13.31 17.02,13.31 17.4,12.93 18.68,12.93 U$1.6
  Bottom 0.508: 16.38,12.17 v16.38,13.31
  Bottom 0.635: C7.1 18.76,9.79 16.38,12.17
UP  (via drill 0.35)
  Top 0.305: U$1.27 30.37,12.04 33.66,12.04 34.16,12.55 v34.29,12.55 35.18,13.44 S1.A
  Bottom 0.305: R9.1 33.53,11.79 v34.29,12.55
VBAT
  Top 0.635: U2.3 15.48,6.89 14.73,6.15 13.55,6.15 12.84,5.44 12.45,5.44 10.88,3.87 J1.1
  Bottom 0.381: C8.1 11.23,2.3 J1.1
  Bottom 0.635: D1.A 16.07,7.85 J1.1
VBUS
  Top 0.305: U$1.7 18.77,12.04 19.18,12.04 19.3,11.91 21.21,11.91 21.72,12.42 21.72,14.96 20.9,15.78 20.14,15.78 19.84,16.08 U$1.2 | J3.VBUS 2.09,9.87 1.49,9.26 | 1.49,9.26 1.17,8.94 | 1.17,8.44 1.09,8.36 1.09,7.62 | 1.09,7.62 1.09,6.48 3.69,3.88 R14.1 | 1.09,7.62 1.09,8.86 1.49,9.26
  Top 0.381: U$1.7 14.48,12.08 13.3,10.9 6.73,10.9 5.7,9.87 J3.VBUS 5.22,9.69
  Top 0.508: C2.1 10.95,8.84 10.73,9.06 | U2.4 12.92,6.86 10.22,9.56 | 1.09,8.36 1.09,8.86 1.17,8.94
  Top 0.635: J3.VBUS 9.92,9.87 10.22,9.56 10.73,9.06
  Bottom 0.635: 5.71,9.87 9.43,9.87 | 5.71,9.87 J3.VBUS | 9.43,9.87 9.5,9.83 11.48,7.85 D1.C | 9.43,9.87 9.11,10.18 IC1.3 6.56,10.71 5.71,9.87
XTAL1
  Top 0.305: U$1.17 24.53,5.03 24.7,4.86 | 24.7,4.86 25.89,3.68 C3.2 | Y1.3 25.44,4.12 24.7,4.86
XTAL2
  Top 0.305: 19.09,1.8 C4.2 19.12,1.82 Y1.1 23.73,3.68 U$1.16

### Text on the board
Document: Tyler Goulding